# EAGLE design interface-2-cart (EAGLE 9.4.2)
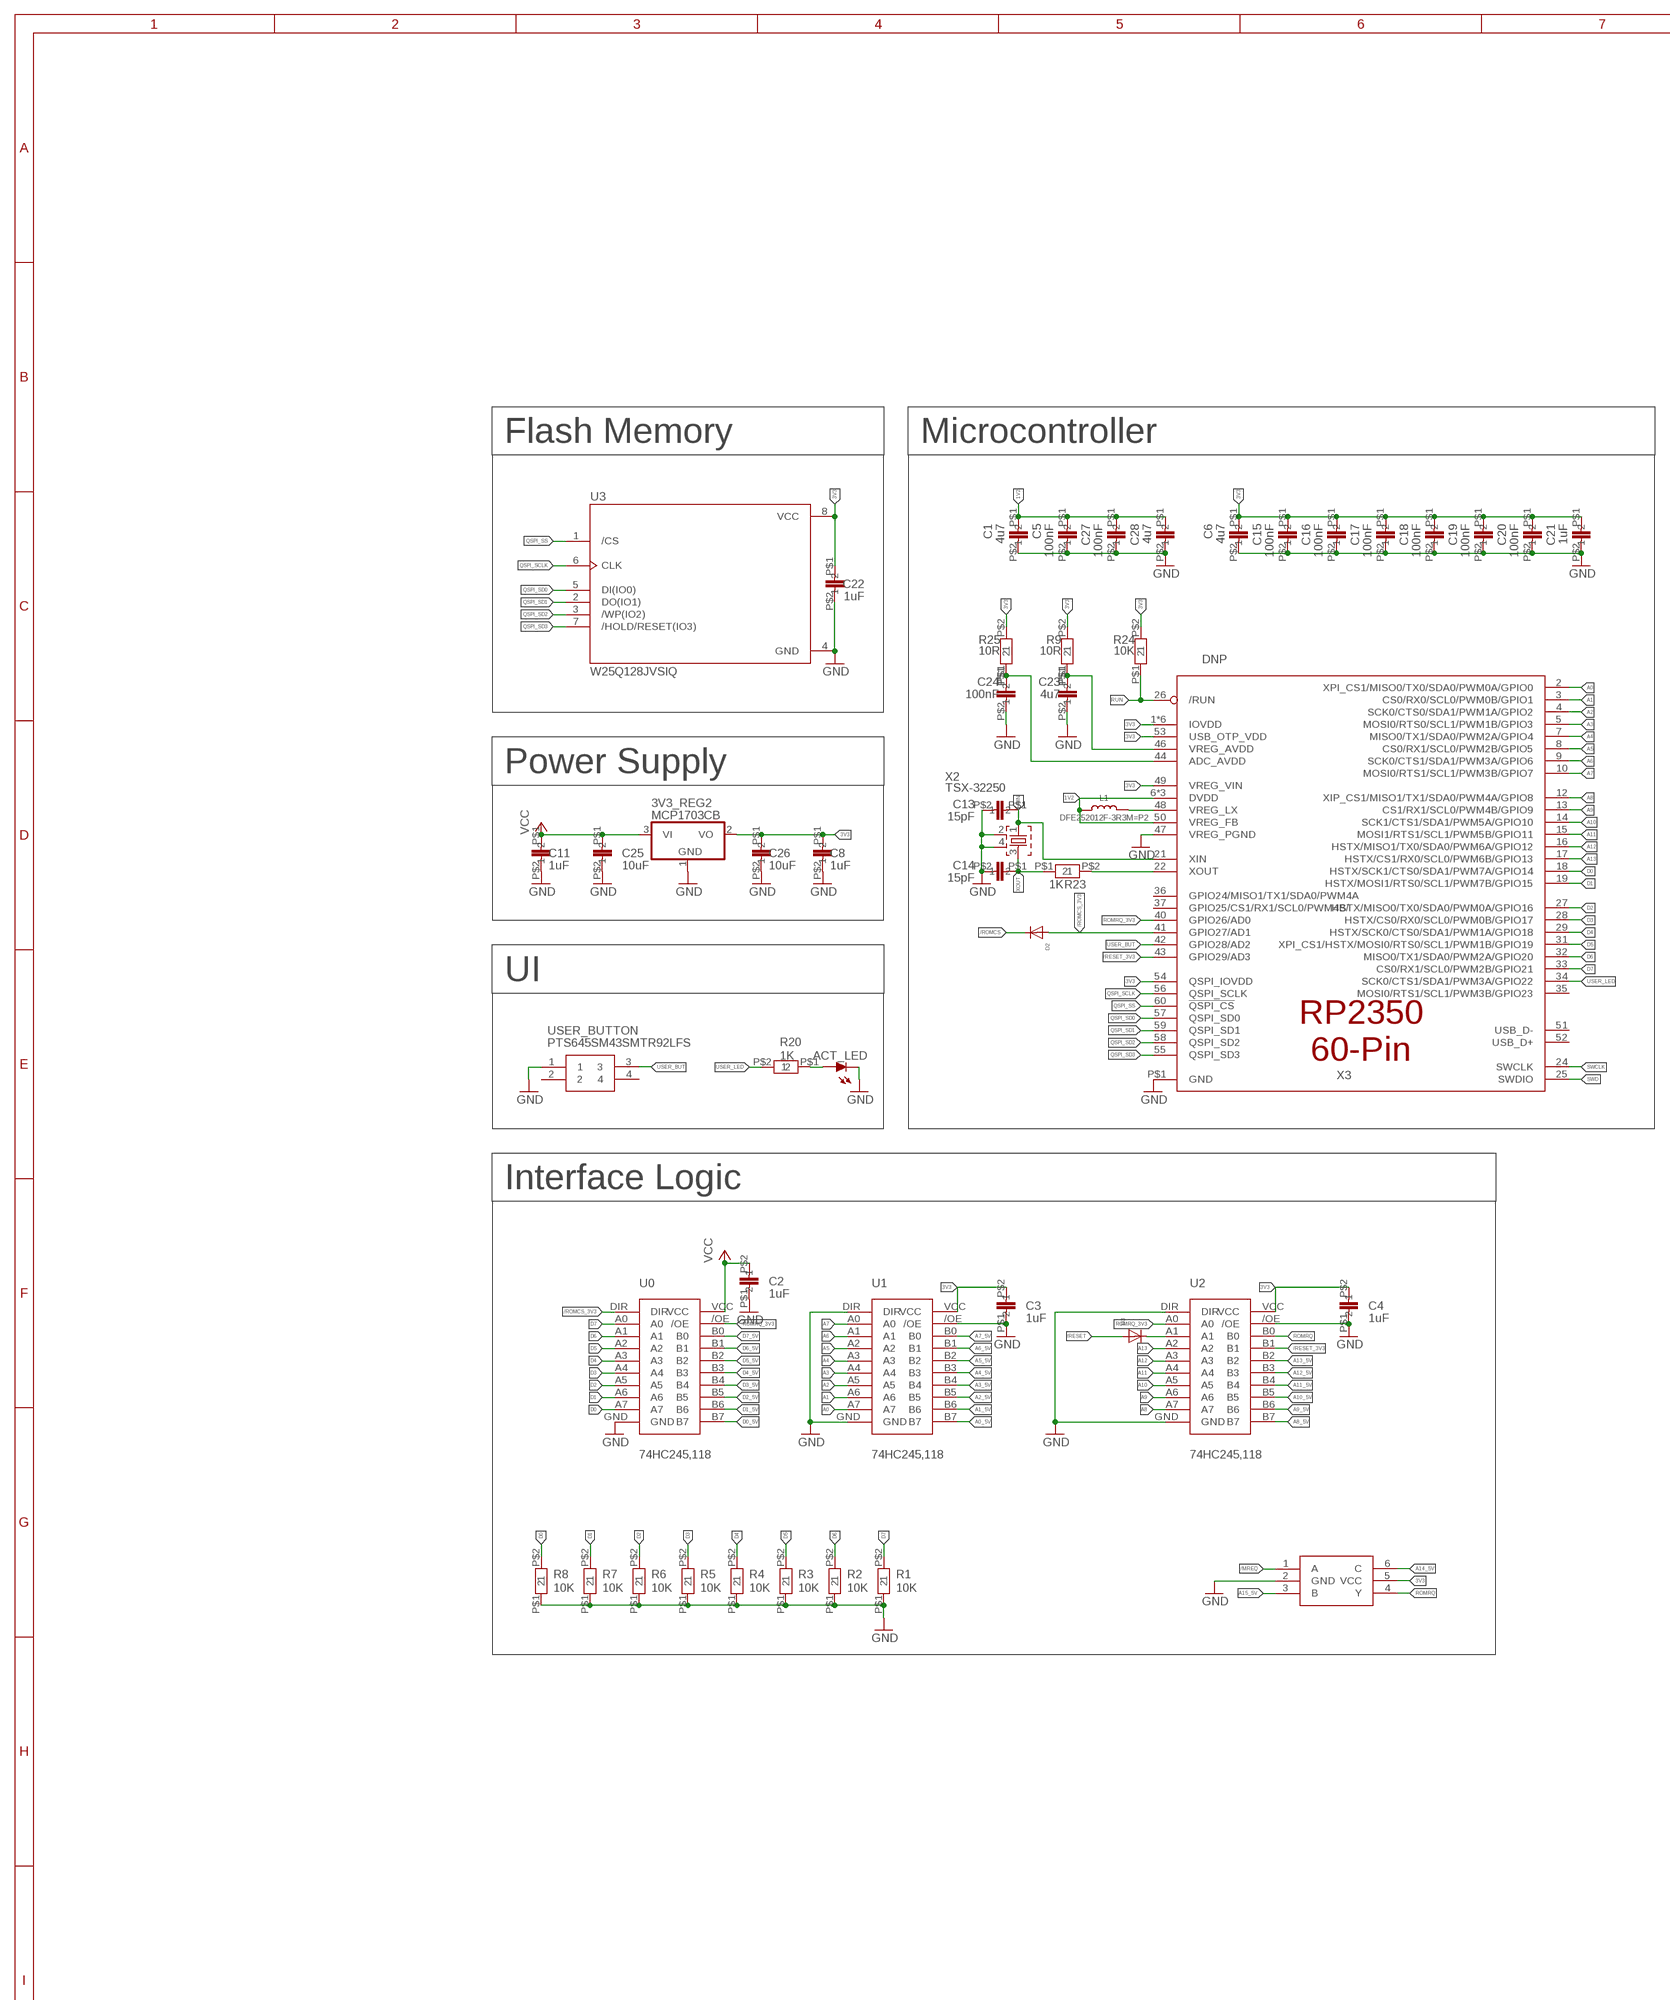
[diagram p0: schematic, sheet 1, part 1 of 2]
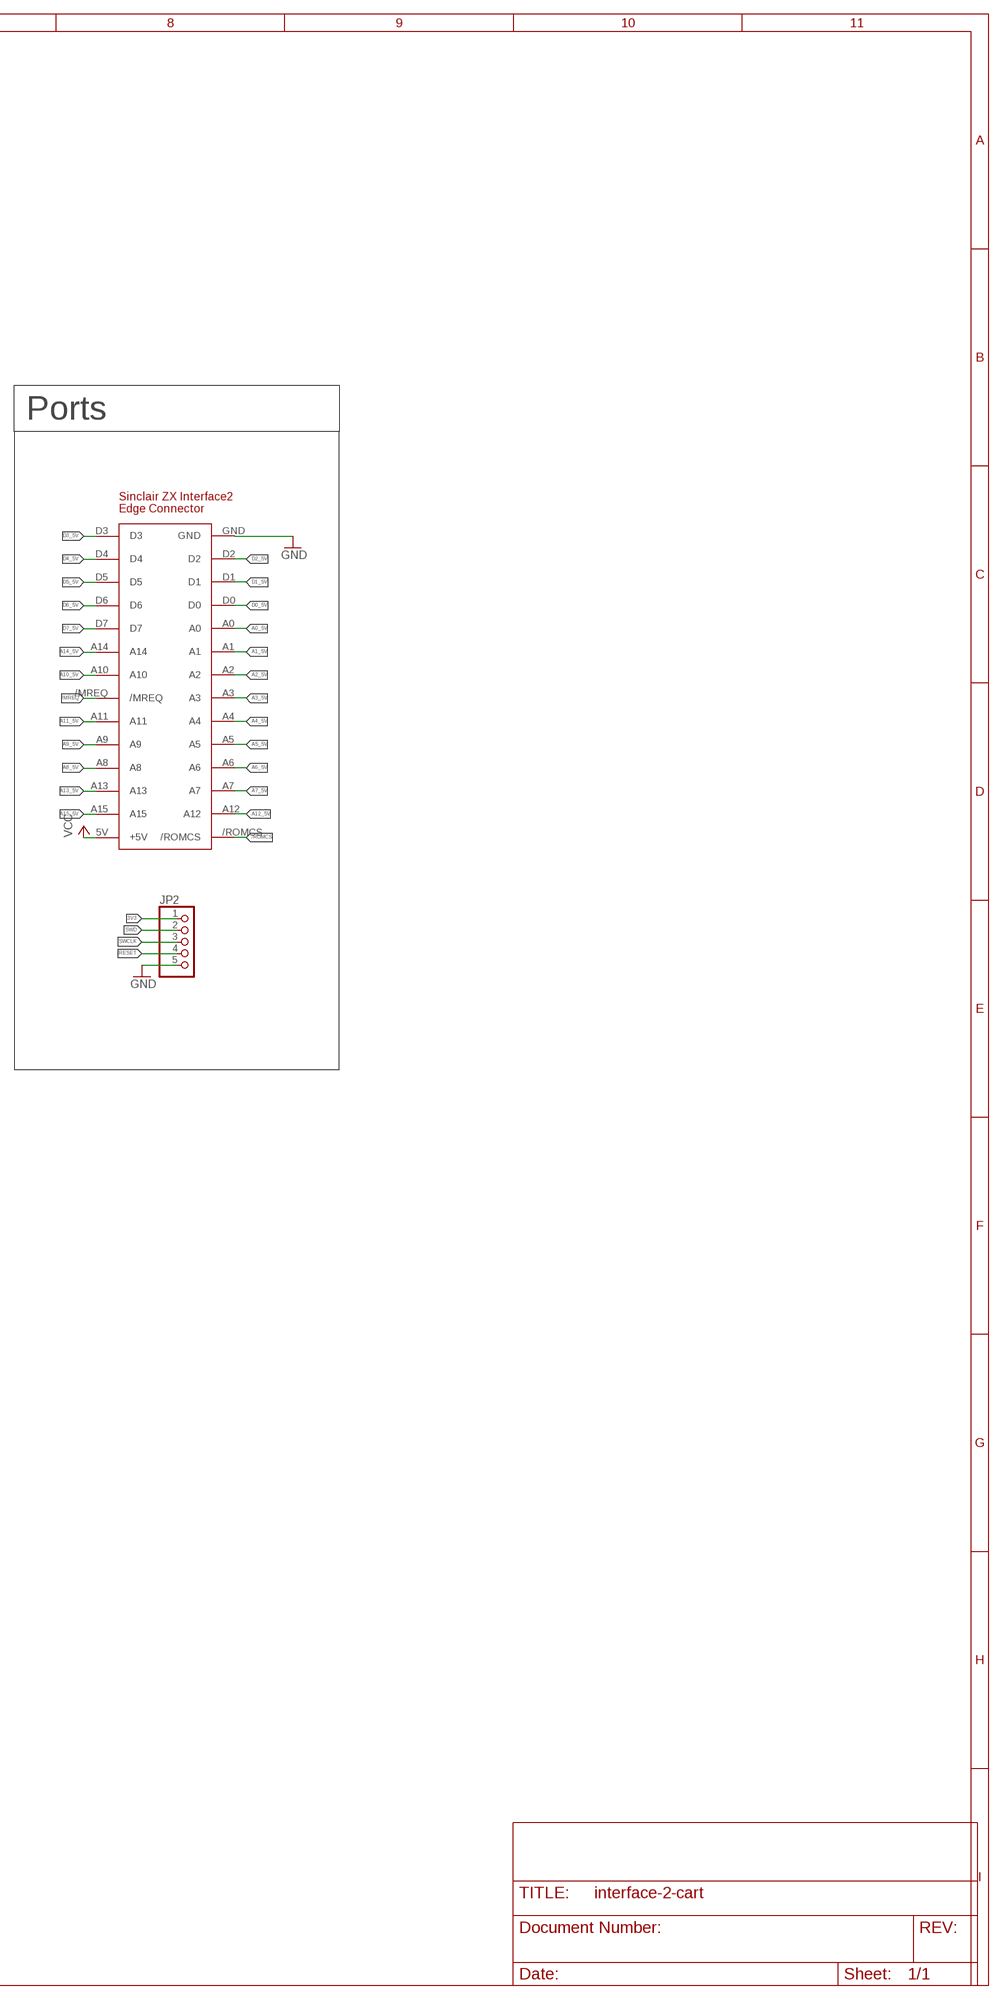
[diagram p1: schematic, sheet 1, part 2 of 2]

## Parts
3V3_REG2  MCP1703CB  [SOT23]
ACT_LED  20mA  LED_LEDCHIP-LED0603MP  [LED_CHIP-LED0603MP]
C1  4u7  CAP-0402  [C0402]
C2  1uF  CAP-0402  [C0402]
C3  1uF  CAP-0402  [C0402]
C4  1uF  CAP-0402  [C0402]
C5  100nF  CAP-0402  [C0402]
C6  4u7  CAP-0402  [C0402]
C8  1uF  CAP-0402  [C0402]
C11  1uF  CAP-0402  [C0402]
C13  15pF  CAP-0402  [C0402]
C14  15pF  CAP-0402  [C0402]
C15  100nF  CAP-0402  [C0402]
C16  100nF  CAP-0402  [C0402]
C17  100nF  CAP-0402  [C0402]
C18  100nF  CAP-0402  [C0402]
C19  100nF  CAP-0402  [C0402]
C20  100nF  CAP-0402  [C0402]
C21  1uF  CAP-0402  [C0402]
C22  1uF  CAP-0402  [C0402]
C23  4u7  CAP-0402  [C0402]
C24  100nF  CAP-0402  [C0402]
C25  10uF  CAP-0402  [C0402]
C26  10uF  CAP-0402  [C0402]
C27  100nF  CAP-0402  [C0402]
C28  4u7  CAP-0402  [C0402]
D2  DIODESOD-323F  [SOD-323F]
D3  DIODESOD-323F  [SOD-323F]
JP2  PINHD-1X5  [1X05]
L1  DFE252012F-3R3M=P2  INDUCTOR  [INDUCTOR_1007]
R1  10K  RES-0402  [0402]
R2  10K  RES-0402  [0402]
R3  10K  RES-0402  [0402]
R4  10K  RES-0402  [0402]
R5  10K  RES-0402  [0402]
R6  10K  RES-0402  [0402]
R7  10K  RES-0402  [0402]
R8  10K  RES-0402  [0402]
R9  10R  RES-0402  [0402]
R20  1K  RES-0402  [0402]
R23  1K  RES-0402  [0402]
R24  10K  RES-0402  [0402]
R25  10R  RES-0402  [0402]
U0  SOP65P640X110-20N  [SOP65P640X110-20N]
U1  SOP65P640X110-20N  [SOP65P640X110-20N]
U2  SOP65P640X110-20N  [SOP65P640X110-20N]
U3  W25Q128JVSIQ  [SOIC127P790X216-8N]
U$1  ZX_I2_ROM_EDGE_CONNECTOR  [ZX_I2_ROM_EDGE_CONNECTOR_V2]
U$2  74LVC1G332GW,125  [SOP65P210X110-6N]
USER_BUTTON  PTS645SM43SMTR92LFS  [PTS645(SMT)]
X2  TSX-32250  [TSX-3225]
X3  DNP  RP2350_QFN60  [QFN60_7MM_REDUCEDEPAD]

## Nets
1V2: C1.P$1 C5.P$1 C27.P$1 C28.P$1 L1.P$1 X3.6(DVDD) X3.23(DVDD) X3.39(DVDD) X3.50(VREG_FB)
3V3: 3V3_REG2.2(VO) C3.P$2 C4.P$2 C6.P$1 C8.P$1 C15.P$1 C16.P$1 C17.P$1 C18.P$1 C19.P$1 C20.P$1 C21.P$1 C22.P$1 C26.P$1 JP2.1 R9.P$2 R24.P$2 R25.P$2 U1.VCC U2.VCC U3.8(VCC) U$2.5(VCC) X3.1(IOVDD) X3.11(IOVDD) X3.20(IOVDD) X3.30(IOVDD) X3.38(IOVDD) X3.45(IOVDD) X3.49(VREG_VIN) X3.53(USB_OTP_VDD) X3.54(QSPI_IOVDD)
/MREQ: U$1./MREQ U$2.1(A)
/RESET: D3.A JP2.4
/RESET_3V3: U2.B1 X3.43(GPIO29/AD3)
/ROMCS: D2.C U$1./ROMCS
/ROMCS_3V3: D2.A U0.DIR X3.41(GPIO27/AD1)
A0: U1.A7 X3.2(XPI_CS1/MISO0/TX0/SDA0/PWM0A/GPIO0)
A0_5V: U1.B7 U$1.A0
A1: U1.A6 X3.3(CS0/RX0/SCL0/PWM0B/GPIO1)
A1_5V: U1.B6 U$1.A1
A2: U1.A5 X3.4(SCK0/CTS0/SDA1/PWM1A/GPIO2)
A2_5V: U1.B5 U$1.A2
A3: U1.A4 X3.5(MOSI0/RTS0/SCL1/PWM1B/GPIO3)
A3_5V: U1.B4 U$1.A3
A4: U1.A3 X3.7(MISO0/TX1/SDA0/PWM2A/GPIO4)
A4_5V: U1.B3 U$1.A4
A5: U1.A2 X3.8(CS0/RX1/SCL0/PWM2B/GPIO5)
A5_5V: U1.B2 U$1.A5
A6: U1.A1 X3.9(SCK0/CTS1/SDA1/PWM3A/GPIO6)
A6_5V: U1.B1 U$1.A6
A7: U1.A0 X3.10(MOSI0/RTS1/SCL1/PWM3B/GPIO7)
A7_5V: U1.B0 U$1.A7
A8: U2.A7 X3.12(XIP_CS1/MISO1/TX1/SDA0/PWM4A/GPIO8)
A8_5V: U2.B7 U$1.A8
A9: U2.A6 X3.13(CS1/RX1/SCL0/PWM4B/GPIO9)
A9_5V: U2.B6 U$1.A9
A10: U2.A5 X3.14(SCK1/CTS1/SDA1/PWM5A/GPIO10)
A10_5V: U2.B5 U$1.A10
A11: U2.A4 X3.15(MOSI1/RTS1/SCL1/PWM5B/GPIO11)
A11_5V: U2.B4 U$1.A11
A12: U2.A3 X3.16(HSTX/MISO1/TX0/SDA0/PWM6A/GPIO12)
A12_5V: U2.B3 U$1.A12
A13: U2.A2 X3.17(HSTX/CS1/RX0/SCL0/PWM6B/GPIO13)
A13_5V: U2.B2 U$1.A13
A14_5V: U$1.A14 U$2.6(C)
A15_5V: U$1.A15 U$2.3(B)
D0: R8.P$2 U0.A7 X3.18(HSTX/SCK1/CTS0/SDA1/PWM7A/GPIO14)
D0_5V: U0.B7 U$1.D0
D1: R7.P$2 U0.A6 X3.19(HSTX/MOSI1/RTS0/SCL1/PWM7B/GPIO15)
D1_5V: U0.B6 U$1.D1
D2: R6.P$2 U0.A5 X3.27(HSTX/MISO0/TX0/SDA0/PWM0A/GPIO16)
D2_5V: U0.B5 U$1.D2
D3: R5.P$2 U0.A4 X3.28(HSTX/CS0/RX0/SCL0/PWM0B/GPIO17)
D3_5V: U0.B4 U$1.D3
D4: R4.P$2 U0.A3 X3.29(HSTX/SCK0/CTS0/SDA1/PWM1A/GPIO18)
D4_5V: U0.B3 U$1.D4
D5: R3.P$2 U0.A2 X3.31(XPI_CS1/HSTX/MOSI0/RTS0/SCL1/PWM1B/GPIO19)
D5_5V: U0.B2 U$1.D5
D6: R2.P$2 U0.A1 X3.32(MISO0/TX1/SDA0/PWM2A/GPIO20)
D6_5V: U0.B1 U$1.D6
D7: R1.P$2 U0.A0 X3.33(CS0/RX1/SCL0/PWM2B/GPIO21)
D7_5V: U0.B0 U$1.D7
GND: 3V3_REG2.1(GND) ACT_LED.C C1.P$2 C2.P$1 C3.P$1 C4.P$1 C5.P$2 C6.P$2 C8.P$2 C11.P$2 C13.P$2 C14.P$2 C15.P$2 C16.P$2 C17.P$2 C18.P$2 C19.P$2 C20.P$2 C21.P$2 C22.P$2 C23.P$2 C24.P$2 C25.P$2 C26.P$2 C27.P$2 C28.P$2 JP2.5 R1.P$1 R2.P$1 R3.P$1 R4.P$1 R5.P$1 R6.P$1 R7.P$1 R8.P$1 U0.GND U1./OE U1.DIR U1.GND U2./OE U2.DIR U2.GND U3.4(GND) U$1.GND U$2.2(GND) USER_BUTTON.1 X2.2 X2.4 X3.47(VREG_PGND) X3.P$1(GND)
N$6: ACT_LED.A R20.P$1
N$9: D3.C U2.A1
N$10: R23.P$2 X3.22(XOUT)
N$11: L1.P$2 X3.48(VREG_LX)
N$12: C23.P$1 R9.P$1 X3.46(VREG_AVDD)
N$13: C24.P$1 R25.P$1 X3.44(ADC_AVDD)
QSPI_SCLK: U3.6(CLK) X3.56(QSPI_SCLK)
QSPI_SD0: U3.5(DI(IO0)) X3.57(QSPI_SD0)
QSPI_SD1: U3.2(DO(IO1)) X3.59(QSPI_SD1)
QSPI_SD2: U3.3(/WP(IO2)) X3.58(QSPI_SD2)
QSPI_SD3: U3.7(/HOLD/RESET(IO3)) X3.55(QSPI_SD3)
QSPI_SS: U3.1(/CS) X3.60(!QSPI_CS)
ROMRQ: U2.B0 U$2.4(Y)
ROMRQ_3V3: U0./OE U2.A0 X3.40(GPIO26/AD0)
RUN: R24.P$1 X3.26(/RUN)
SWCLK: JP2.3 X3.24(SWCLK)
SWD: JP2.2 X3.25(SWDIO)
USER_BUT: USER_BUTTON.3 X3.42(GPIO28/AD2)
USER_LED: R20.P$2 X3.34(SCK0/CTS1/SDA1/PWM3A/GPIO22)
VCC: 3V3_REG2.3(VI) C2.P$2 C11.P$1 C25.P$1 U0.VCC U$1.5V(+5V)
XIN: C13.P$1 X2.1 X3.21(XIN)
XOUT: C14.P$1 R23.P$1 X2.3
Unconnected: USER_BUTTON.2 USER_BUTTON.4 X3.35(MOSI0/RTS1/SCL1/PWM3B/GPIO23) X3.36(GPIO24/MISO1/TX1/SDA0/PWM4A) X3.37(GPIO25/CS1/RX1/SCL0/PWM4B/) X3.51(USB_D-) X3.52(USB_D+)

## Notes on the sheet
- Flash Memory | Microcontroller | Ports
- Power Supply
- UI
- Interface Logic

## Library data of the parts
3V3_REG2 = linear:MCP1703: 250 mA, 16V, Low Quiescent Current LDO Regulator Source: http://ww1.microchip.com/downloads/en/DeviceDoc/22049b.pdf
ACT_LED = 52101-101-REV-A_v16:LED_LED: LED Various Types
C1-C6 C8 C11 C13-C28 = res-small-footprint:CAP-0402
D2 D3 = adafruit:DIODE: Diode SMADIODE - SMA Surface Mount Package 20V 1A Schottky Diode Digikey: 641-1014-6-ND DO-1N4148 - Through Hole Small Current Diode SOD-123 20V 1 A (.5mV Vf) Schottky Diode - Digikey: MBRX120TPMSCT-ND SOD-323 10V 570mA (.38mV Vf, 3ns) Schottky Diode - Digikey: ZLLS410CT-ND SOD-523 30V 30mA Schottky Diode (RB751S-40TE61) - Digikey: RB751S-40TE61CT-ND SOT23-R/W - SOT23 Package (R = Solder Paste/Reflow Ovens, W = Hand-Soldering) BAT54Film 40V 300mA - Digikey: 497-7162-1-ND
JP2 = pinhead:PINHD-1X5: PIN HEADER
L1 = microbuilder:INDUCTOR: Inductors 0603: 10nH Ceramic Inductor - microwire antenna/RF (Digikey: 712-1434-2-ND) 0805: 560nH Ceramic Inductor - RF (Digikey: 553-1047-1-ND) 270nH Ceramic Inductor - Q = 40@250MHz, +-5%, 1 Ohm DC Resistance (Digikey: 535-10506-2-ND) 1007 (2518 Metric) SMT: 10µH 10% 250mOhm 820mA 1007 Inductor (Digikey: 587-2189-1-ND) 22µH 10% 500mOhm 580mA 1007 Inductor (Digikey: 587-2190-1-ND) 47µH 10% 950mOhm 420mA 1007 Inductor (Digikey: 587-2191-1-ND) 47µH 5% 100mOhm 1A 1008 Inductor (Digikey: 732-1816-1-ND) 5.0x5.0mm (Taiyo Yuden NR5040 Series) 6.8µH 20% 2.3A 64mOhm Inductor (Digikey: 587-2374-2-ND) 5.0x5.0mm (TDK VLC5045 Series) 4.7µH 20% 3.3A 34mOhm Inductor (Digikey: 445-6526-1-ND) 6.8µH 20% 2.7A 46mOhm Inductor (Digikey: 445-6527-1-ND) 6.0x6.0mm (TDK VLC6045 Series) 4.7µH 20% 3.8A 27mOhm Inductor (Digikey: 445-6538-2-ND) 6.8µH 20% 3A 41mOhm Inductor (Digikey: 445-6540-1-ND) 6.2µH 30% 2.2A 45mOhm Inductor (Digikey: SRR5028-6R2YCT-ND) - Not TDK VLC6045 but footprint should match 6.0x6.0mm (TDK SLF6045 Series) 6.8uH 30% 2A 33mOhm Inductor (Digikey: 445-4572-1-ND, Mouser: 810-SLF645T6R8N2R0PF) 6.0x6.0mm (Sumida CDRH5D28 Series) 6.2uH 30% 1.8A 45mOhm Inductor (Digikey: 308-1542-1-ND) Taiyo Yuden NR3015T2R2M - 2.2uH 20% 1.5A (Digikey: 587-1648-2-ND, Mouser: 963-NR3015T2R2M) - Used with TI TPS62172 CoilCraft RFID Transponder Coil - MA5532-AE (For use with AS3935 Lightning Sensor) Taiyo Yuden NRH2412T2R2MNGH - 2.2uH 20% 1AA (Digikey: 587-3443-1-ND) - Used with TI LM3671 Vishay IHLP 1.0uH Molded Inductor - 24mOhm DCR, 5A, +/-20%, -55°C-125°C (Digikey: 541-1319-1-ND)
R1-R9 R20 R23-R25 = res-small-footprint:RES-0402
U0 U1 U2 = SOP65P640X110-20N:SOP65P640X110-20N; A1_MIN: 0.05; A_MAX: 1.1; A_MIN: 1.1; A_NOM: 1.1; B_MAX: 0.3; B_MIN: 0.19; B_NOM: 0.245; D2_MAX: 0.0; D_MAX: 6.6; D_MIN: 6.4; D_NOM: 6.5; E1_MAX: 4.5; E1_MIN: 4.3; E1_NOM: 4.4; E2_MAX: 0.0; ENOM: 0.65; E_MAX: 6.6; E_MIN: 6.2; E_NOM: 6.4; L_MAX: 0.75; L_MIN: 0.5; L_NOM: 0.625; MANUFACTURER: Nexperia USA; PIN_COUNT: 20.0; SNAPEDA_PACKAGE_ID: 105184; STANDARD: IPC 7351B
U3 = W25Q128JVSIQ:W25Q128JVSIQ: Check availability <https://pricing.snapeda.com/parts/W25Q128JVSIQ/Winbond%20Electronics/view-part?ref=eda>; AVAILABILITY: In Stock; CHECK_PRICES: https://www.snapeda.com/parts/W25Q128JVSIQ/Winbond+Electronics/view-part/?ref=eda; DESCRIPTION: FLASH - NOR Memory IC 128Mb (16M x 8) SPI - Quad I/O, QPI, DTR 133 MHz 8-SOIC; MF: Winbond Electronics; MP: W25Q128JVSIQ; PACKAGE: SOIC-8 Winbond Electronics; PRICE: None; PURCHASE-URL: https://www.snapeda.com/api/url_track_click_mouser/?unipart_id=1054022&manufacturer=Winbond Electronics&part_name=W25Q128JVSIQ&search_term=None; SNAPEDA_LINK: https://www.snapeda.com/parts/W25Q128JVSIQ/Winbond+Electronics/view-part/?ref=snap
U$1 = zxs_i2_rom_edge_connector:ZX_I2_ROM_EDGE_CONNECTOR: Edge connector pro ROM modul pro Interface 2 počítače ZX Spectrum
U$2 = 74LVC1G332GW_125:74LVC1G332GW,125
USER_BUTTON = PTS645SM43SMTR92LFS:PTS645SM43SMTR92LFS: C & K COMPONENTS - PTS645SM43SMTR92LFS - SWITCH, SPST, 0.05A, 12VDC, SMD, 4.3MM Source: Datasheet <http://www.farnell.com/datasheets/1914518.pdf>; DESCRIPTION: C & K COMPONENTS - PTS645SM43SMTR92LFS - SWITCH, SPST, 0.05A, 12VDC, SMD, 4.3MM; HEIGHT: mm; MANUFACTURER_NAME: C & K COMPONENTS; MANUFACTURER_PART_NUMBER: PTS645SM43SMTR92LFS; MOUSER_PART_NUMBER: 611-PTS645SM43SMTR92; MOUSER_PRICE-STOCK: https://www.mouser.com/Search/Refine.aspx?Keyword=611-PTS645SM43SMTR92
X2 = TSX-3225:TSX-3225: MHz RANGE CRYSTAL UNIT Source: Epson Toyocom Check availability <https://pricing.snapeda.com/parts/TSX-3225/EPSON/view-part?ref=eda>; AVAILABILITY: Not in stock; DESCRIPTION: 38.4MHz ±10ppm Crystal 8.5pF 40 Ohms 4-SMD, No Lead; MF: EPSON; MP: TSX-3225; PACKAGE: SMD-4 EPSON; PRICE: None
X3 = adafruit_micro:RP2350

## Board
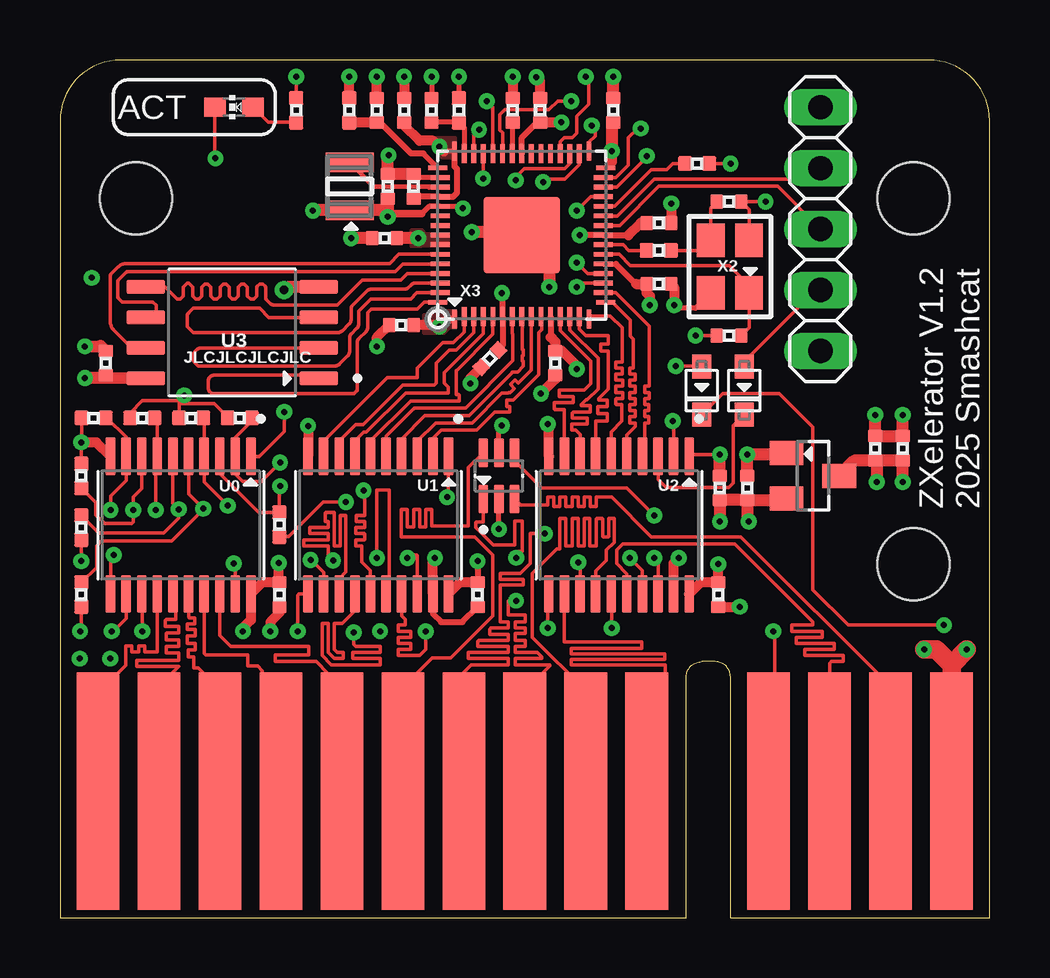
[diagram p2: board, top side]
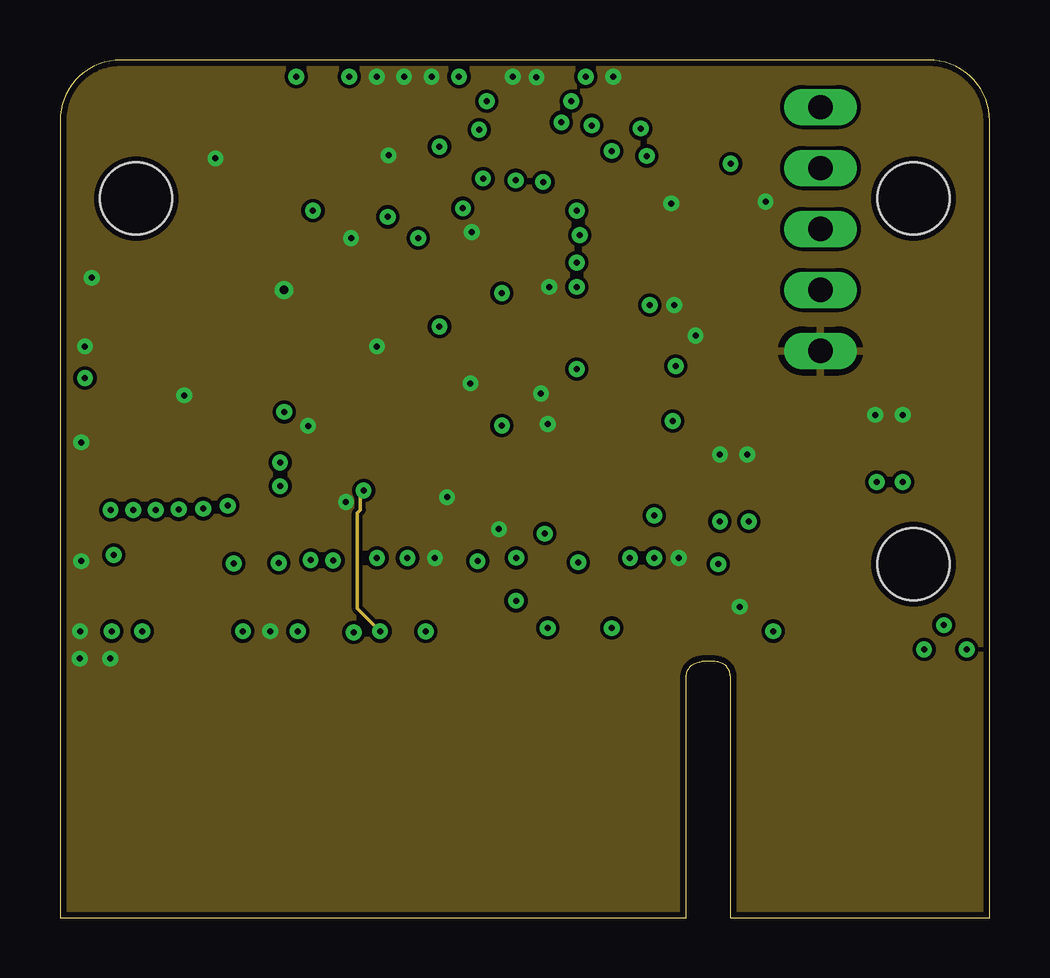
[diagram p3: board, inner layer Route2]
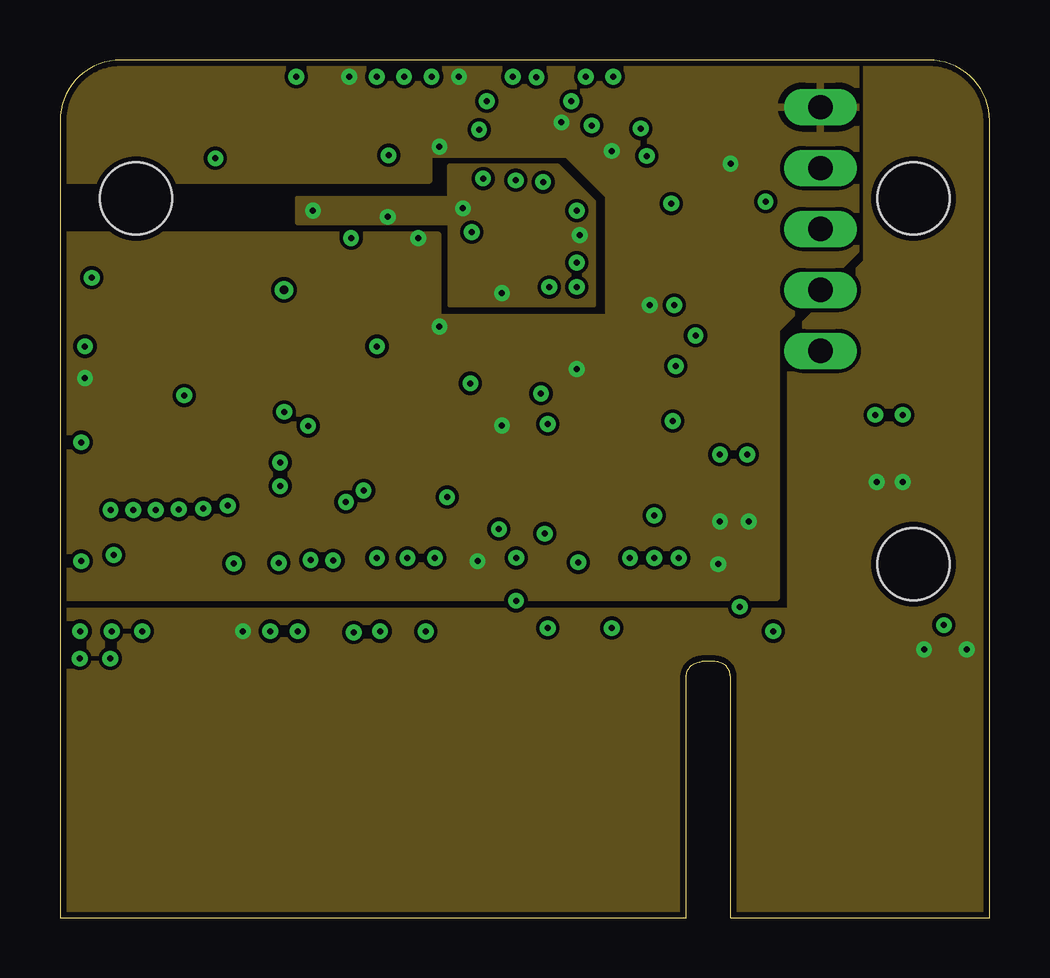
[diagram p4: board, inner layer Route15]
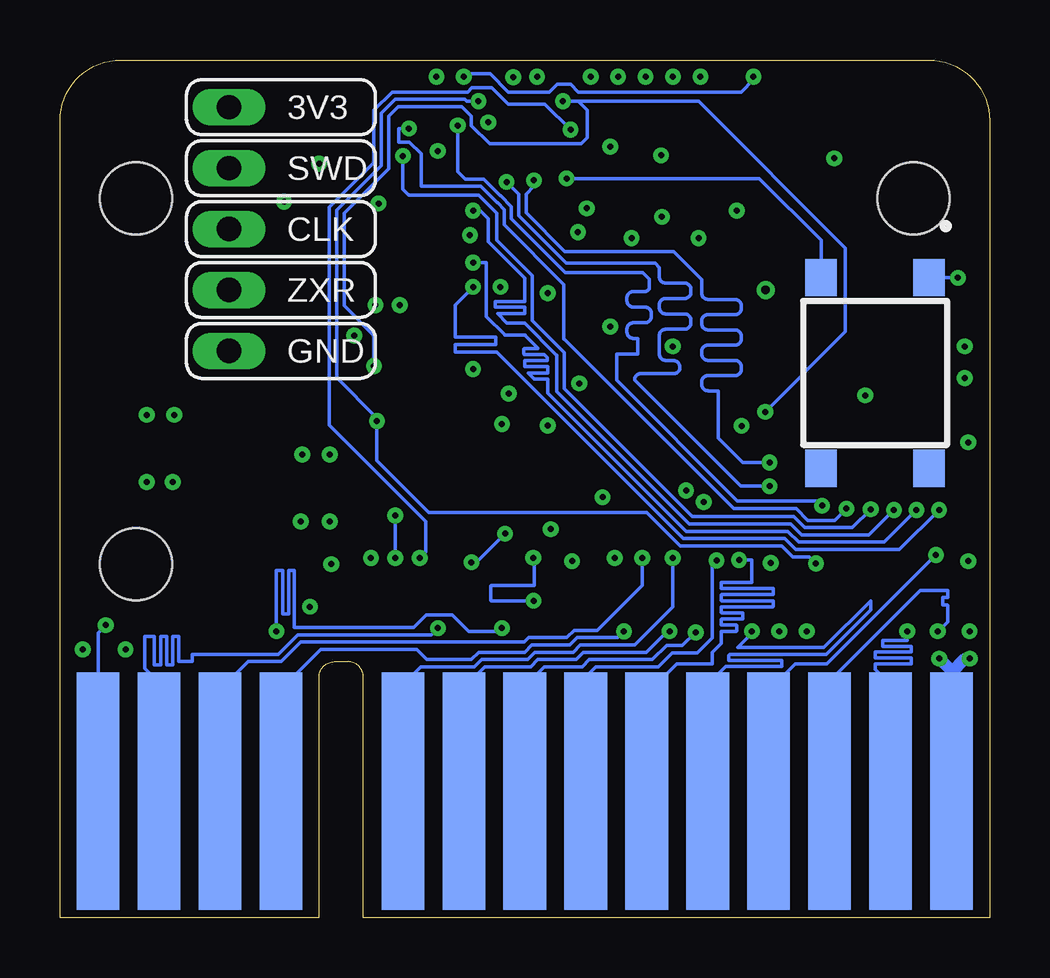
[diagram p5: board, bottom side, seen from below]

Size 38.73 x 35.75 mm. Coordinates in mm from the lower left corner, seen from the top.
Outline: 0,0 26.1,0 26.1,10.03 arc-90 26.73,10.67 27.3,10.67 arc-90 27.94,10.03 27.94,0 38.73,0 38.73,33.21 arc90 36.2,35.75 2.54,35.75 arc90 0,33.21 0,0
Copper layers (1+2*15+16): Top 0.035mm / dielectric 0.1mm / Route2 0.0175mm / dielectric 1.265mm / Route15 0.0175mm / dielectric 0.1mm / Bottom 0.035mm
Design rules "moje_1 *": minimum track width 6mil, minimum drill 0.2mm, track to track 6mil, track to pad 6mil, pad to pad 6mil, via to via 6mil, smd to smd 6mil, copper to edge 10mil, drill to drill 6mil, minimum pad ring 10mil, minimum via ring 8mil, stop-mask expansion 4mil, vias tented up to drill 0mil, thermal gap 10mil
Holes 3 mm at 3.17,29.97 35.56,29.97 35.56,14.73

### Footprints (pad centres in the part's own frame; a part is rotated, then mirrored left to right if it is on the bottom)
SOT23 = smd 1 x 1.4: 1 -0.95,-1.1; 2 0.95,-1.1; 3 0,1.1
LED_CHIP-LED0603MP = smd 0.8 x 0.9: A 0,-0.794; C 0,0.794
C0402 = smd 0.524 x 0.6: P$1 -0.508,0; P$2 0.508,0
SOD-323F = smd 1 x 0.8: A -1,0; C 1,0
1X05 = drill 1.016 long: 1 -5.08,0; 2 -2.54,0; 3 0,0; 4 2.54,0; 5 5.08,0
INDUCTOR_1007 = smd 0.8 x 2: P$1 -1,0; P$2 1,0
0402 = smd 0.6 x 0.6: P$1 -0.5,0; P$2 0.5,0
SOP65P640X110-20N = smd 1.57 x 0.41: /OE 2.87,2.275; A0 -2.87,2.275; A1 -2.87,1.625; A2 -2.87,0.975; A3 -2.87,0.325; A4 -2.87,-0.325; A5 -2.87,-0.975; A6 -2.87,-1.625; A7 -2.87,-2.275; B0 2.87,1.625; B1 2.87,0.975; B2 2.87,0.325; B3 2.87,-0.325; B4 2.87,-0.975; B5 2.87,-1.625; B6 2.87,-2.275; B7 2.87,-2.925; DIR -2.87,2.925; GND -2.87,-2.925; VCC 2.87,2.925
SOIC127P790X216-8N = smd 1.61 x 0.58: 1 -3.605,1.905; 2 -3.605,0.635; 3 -3.605,-0.635; 4 -3.605,-1.905; 5 3.605,-1.905; 6 3.605,-0.635; 7 3.605,0.635; 8 3.605,1.905
ZX_I2_ROM_EDGE_CONNECTOR_V2 = smd 1.778 x 9.906: 5V 10.16,5.08; /MREQ -7.62,5.08; A8 2.54,5.08; A9 -2.54,5.08; A10 -10.16,5.08; A11 -5.08,5.08; A13 5.08,5.08; A14 -12.7,5.08; A15 7.62,5.08; D3 -25.4,5.08; D4 -22.86,5.08; D5 -20.32,5.08; D6 -17.78,5.08; D7 -15.24,5.08 | smd 1.778 x 9.906 bottom: /ROMCS 10.16,5.08; A0 -15.24,5.08; A1 -12.7,5.08; A2 -10.16,5.08; A3 -7.62,5.08; A4 -5.08,5.08; A5 -2.54,5.08; A6 2.54,5.08; A7 5.08,5.08; A12 7.62,5.08; D0 -17.78,5.08; D1 -20.32,5.08; D2 -22.86,5.08; GND -25.4,5.08
SOP65P210X110-6N = smd 1.19 x 0.4: 1 -0.96,0.65; 2 -0.96,0; 3 -0.96,-0.65; 4 0.96,-0.65; 5 0.96,0; 6 0.96,0.65
PTS645(SMT) = smd 1.55 x 1.3: 1 -3.975,2.25; 2 3.975,2.25; 3 -3.975,-2.25; 4 3.975,-2.25
TSX-3225 = smd 1.4 x 1.15: 1 0,-1.6; 2 2.2,-1.6; 3 2.2,0; 4 0,0
QFN60_7MM_REDUCEDEPAD = smd 0.8 x 0.2: 1 -3.5,2.8; 2 -3.4,2.4; 3 -3.4,2; 4 -3.4,1.6; 5 -3.4,1.2; 6 -3.4,0.8; 7 -3.4,0.4; 8 -3.4,0; 9 -3.4,-0.4; 10 -3.4,-0.8; 11 -3.4,-1.2; 12 -3.4,-1.6; 13 -3.4,-2; 14 -3.4,-2.4; 15 -3.5,-2.8; 31 3.5,-2.8; 32 3.4,-2.4; 33 3.4,-2; 34 3.4,-1.6; 35 3.4,-1.2; 36 3.4,-0.8; 37 3.4,-0.4; 38 3.4,0; 39 3.4,0.4; 40 3.4,0.8; 41 3.4,1.2; 42 3.4,1.6; 43 3.4,2; 44 3.4,2.4; 45 3.5,2.8 | smd 0.2 x 0.8: 16 -2.8,-3.5; 17 -2.4,-3.4; 18 -2,-3.4; 19 -1.6,-3.4; 20 -1.2,-3.4; 21 -0.8,-3.4; 22 -0.4,-3.4; 23 0,-3.4; 24 0.4,-3.4; 25 0.8,-3.4; 26 1.2,-3.4; 27 1.6,-3.4; 28 2,-3.4; 29 2.4,-3.4; 30 2.8,-3.5; 46 2.8,3.5; 47 2.4,3.4; 48 2,3.4; 49 1.6,3.4; 50 1.2,3.4; 51 0.8,3.4; 52 0.4,3.4; 53 0,3.4; 54 -0.4,3.4; 55 -0.8,3.4; 56 -1.2,3.4; 57 -1.6,3.4; 58 -2,3.4; 59 -2.4,3.4; 60 -2.8,3.5 | smd 3.2 x 3.2: P$1 0,0

### Placement (x,y rotation side)
3V3_REG2  31.37,18.41 270 top
ACT_LED  7.25,33.78 90 top
C1  24.96,28.96 0 top
C2  9.14,13.46 90 top
C3  20,33.66 270 top
C4  17.4,13.46 90 top
C5  18.86,33.66 90 top
C6  14.73,30.48 90 top
C8  28.64,17.91 90 top
C11  33.97,19.56 90 top
C13  27.88,24.26 180 top
C14  27.88,29.84 0 top
C15  24.96,26.42 0 top
C16  20.64,23.11 270 top
C17  27.43,13.46 270 top
C18  1.91,23.11 90 top
C19  14.22,24.7 180 top
C20  14.34,33.66 90 top
C21  13.53,28.32 180 top
C22  23.05,33.66 90 top
C23  13.2,33.66 90 top
C24  15.48,33.66 90 top
C25  35.12,19.56 90 top
C26  27.5,17.91 90 top
C27  17.91,23.3 225 top
C28  13.65,30.48 90 top
D2  26.73,21.97 270 top
D3  28.51,21.97 270 top
JP2  31.69,28.7 270 top
L1  12.06,30.48 90 top
R1  7.49,20.83 0 top
R2  9.14,16.38 90 top
R3  5.46,20.83 0 top
R4  0.89,13.46 90 top
R5  0.89,16.26 90 top
R6  3.43,20.83 0 top
R7  0.89,18.41 270 top
R8  1.4,20.83 0 top
R9  12.05,33.66 90 top
R20  9.84,33.66 90 top
R23  24.96,27.81 180 top
R24  26.54,31.43 0 top
R25  16.62,33.66 90 top
U0  5.03,16.36 270 top
U1  13.26,16.36 270 top
U2  23.29,16.36 270 top
U3  7.18,24.38 180 top
U$1  26.99,0.19 0 top
U$2  18.29,18.41 90 top
USER_BUTTON  4.78,22.71 270 bottom
X2  27.11,26.04 90 top
X3  19.24,28.45 90 top

### Tracks (layer width: path | path; a pad name or v marks a point on that pad's centre or on a via)
1V2  (via drill 0.25)
  Top 0.203: C5.P$1 18.84,33.13 X3.39 | 15.07,29.34 15.38,29.65 X3.50 16.71,29.65 v16.79,29.57
  Top 0.254: 23.69,28.45 X3.23 v21.65,28.45 | v18.41,26.04 18.44,26.01 X3.6 18.44,23.84 C27.P$1
  Top 0.305: v13.65,29.21 13.78,29.34 15.07,29.34
  Top 0.406: C1.P$1 24.19,28.96 23.69,28.45
  Top 0.508: C28.P$1 v13.65,29.21 13.38,29.48 L1.P$1 10.56,29.48 v10.54,29.46
  pour Route15: 9.91,30 16.23,30 16.23,31.34 20.73,31.34 22.23,29.84 22.23,25.53 16.26,25.53 16.26,28.96 9.91,28.96
3V3  (via drill 0.25)
  Top 0.152: R24.P$2 v27.94,31.43
  Top 0.203: U$2.5 18.29,20.26 18.41,20.39 v18.41,20.51 | C3.P$2 19.88,33.15 | X3.45 15.99,31.95 | v16.62,35.05 R25.P$2 | X3.1 16.19,24.95 | X3.20 23.16,27.25 | X3.30 22.99,31.5 | 14.8,30.05 C6.P$1
  Top 0.254: X3.38 19.24,32.51 19.88,33.15 | X3.11 20.44,24.19 | 23.16,27.25 23.99,26.42 | 14.8,30.05 X3.49 16.38,30.05 16.55,30.21 16.55,31.21 16.44,31.31 X3.45 | v17.4,14.86 C4.P$2
  Top 0.356: C18.P$1 1.79,22.49
  Top 0.406: R9.P$2 v12.05,35.05 | C20.P$1 14.34,33.02 14.98,32.38 15.56,32.38 v15.81,32.13 15.99,31.95 | 20.44,24.19 20.64,24 C16.P$1 20.92,23.62 21.53,23.01 v21.53,22.86 | 16.19,24.95 15.88,24.64 v15.81,24.64 15.75,24.7 C19.P$1 | 23.99,26.42 C15.P$1 24.45,26.04 24.57,25.91 v24.57,25.53 | C3.P$2 v20.88,33.16 v20.89,33.15 | v22.99,31.95 22.99,31.5 | C4.P$2 16.67,13.97 U1.VCC | U2.VCC 26.7,13.97 C17.P$1 v27.43,14.73
  Top 0.508: 1.79,22.49 v1.04,22.49 | v14.92,28.32 C21.P$1 | C8.P$1 C26.P$1 v27.5,16.51 | U3.8 1.78,22.49 C18.P$1 | C22.P$1 22.99,33.09 v22.99,31.95 | C8.P$1 30.15,17.4 3V3_REG2.2 | C8.P$1 28.64,16.57 v28.7,16.51
  pour Route15 (rank 2): -2.29,39.37 33.15,39.37 33.15,27.81 29.84,24.51 29.84,13.34 -2.29,13.34 -2.29,28.45 15.75,28.45 15.75,25.02 22.86,25.02 22.86,30.1 21.13,31.83 15.37,31.83 15.37,30.73 -2.29,30.73
  pour Top (no thermals): 15.6,32.51 16.46,32.51 16.46,31.67 15.93,31.67 15.6,32
  pour Top (no thermals): 16.48,24.59 16.23,24.59 16,24.36 15.16,24.36 15.16,25.12 15.72,25.12 15.88,25.27 16.48,25.27
  pour Top (no thermals): 16.18,28.5 15.24,28.5 15.09,28.65 14.63,28.65 14.63,27.99 15.06,27.99 15.09,28.02 16.18,28.02
/MREQ  (via drill 0.25)
  Top 0.152: U$1./MREQ 19.37,9.46 20.4,10.49 20.4,10.54 18.97,10.54 18.97,10.79 20.07,10.79 20.07,10.87 19.89,11.05 18.97,11.05 18.97,11.3 19.38,11.3 19.38,11.56 18.97,11.56 18.97,11.84 19.38,11.84 19.38,12.06 18.97,12.06 18.97,12.32 19.38,12.32 19.38,12.62 18.67,12.62 18.67,13.21 v19,13.21 | v19.01,15 19.01,15.27 19.25,15.27 19.25,16.54 18.95,16.54 18.95,15.53 18.04,15.53 17.32,16.25 17.32,16.46 17.35,16.48 17.63,16.48 17.64,16.5 U$2.1
  Bottom 0.152: v19,13.21 20.75,13.21 arc90 20.78,13.23 20.78,13.82 arc90 20.75,13.84 18.97,13.84 18.97,14.96 v19.01,15
/RESET
  Top 0.152: JP2.4 31.5,26.16 28.51,23.18 D3.A
/RESET_3V3  (via drill 0.25)
  Top 0.152: X3.43 17.24,32.62 v17.46,32.84 | v23.75,14.99 24.27,14.47 U2.B1
  Bottom 0.152: v17.46,32.84 18.53,33.91 20.07,33.91 20.75,34.59 21.58,34.59 21.75,34.42 24.89,34.42 25.65,33.66 25.65,31.47 27.51,29.62 27.51,20.52 23.5,16.51 23.5,15.24 v23.75,14.99
/ROMCS  (via drill 0.25)
  Top 0.152: D2.C 27.61,21.84 29.97,21.84 31.37,20.45 31.37,13.66 32.84,12.19 v36.83,12.19
  Bottom 0.152: U$1./ROMCS 37.15,11.87 v36.83,12.19
/ROMCS_3V3  (via drill 0.25)
  Top 0.152: v17.78,34.04 18.03,33.79 18.03,31.86 X3.41 | v25.65,22.99 26.72,22.99 D2.A | v9.35,21.08 9.35,20.27 8.31,19.23 U0.DIR
  Bottom 0.152: v9.35,21.08 6.01,24.42 6.01,27.91 12.13,34.04 17.14,34.04 | v17.78,34.04 17.14,34.04 | 17.14,34.04 16.76,33.66 16.76,32.51 17.02,32.26 20.83,32.26 21.59,33.02 21.59,33.4 22,33.81 24.64,33.81 25.04,33.4 25.04,31.22 26.9,29.36 26.9,25.5 25.65,24.26 v25.65,22.99
A0
  Top 0.152: X3.2 16.84,24.41 16.39,23.96 15.95,23.96 14.88,22.9 14.88,22.51 13.63,22.51 10.95,19.82 10.95,19.27 U1.A7
A0_5V  (via drill 0.25)
  Top 0.152: U1.B7 9.96,13.49 9.91,13.44 v9.91,11.94
  Bottom 0.152: U$1.A0 11.75,9.72 11,10.46 8.66,10.46 8.66,10.72 10.87,10.72 10.87,10.92 10.82,10.97 6.81,10.97 4.95,12.83 4.95,13.21 6.91,11.25 10.49,11.25 9.91,11.84 v9.91,11.94
A1
  Top 0.152: U1.A6 11.63,19.86 12.32,20.55 12.64,20.55 14.28,22.19 15.59,22.19 15.67,22.27 15.67,23.12 16.21,23.66 16.52,23.66 17.24,24.38 X3.3
A1_5V  (via drill 0.25)
  Top 0.152: U1.B6 10.98,14.39 10.46,14.91 v10.44,14.91
  Bottom 0.152: U$1.A1 14.29,9.34 13.04,10.58 11.56,10.58 11.56,11.04 arc45 11.55,11.06 11.18,11.42 arc-45 11.18,11.44 11.18,11.91 arc90 11.15,11.94 10.57,11.94 arc-90 10.54,11.96 10.54,12.17 arc-90 10.57,12.19 11.15,12.19 arc90 11.18,12.22 11.18,12.42 arc90 11.15,12.45 10.31,12.45 arc-90 10.29,12.47 10.29,12.68 arc-90 10.31,12.7 11.15,12.7 arc90 11.18,12.72 11.18,12.93 arc90 11.15,12.95 9.04,12.95 arc-90 9.02,12.98 9.02,13.18 arc-90 9.04,13.21 11.15,13.21 arc90 11.18,13.23 11.18,13.44 arc90 11.15,13.46 9.04,13.46 arc-90 9.02,13.49 9.02,13.72 11.18,13.72 11.18,13.97 9.91,13.97 9.91,14.91 v10.44,14.91
A2
  Top 0.152: X3.4 17.64,24.35 16.02,22.73 16.02,22.29 16.18,22.12 16.18,21.89 arc-90 16.15,21.87 15.54,21.87 14.4,21.87 12.77,20.24 12.66,20.24 12.28,19.86 U1.A5
A2_5V  (via drill 0.25)
  Top 0.152: v11.38,14.88 11.18,15.09 11.18,15.49 10.16,15.49 10.16,15.75 11.18,15.75 11.18,16 10.41,16 10.41,16.26 11.18,16.26 11.18,16.51 11.05,16.51 11.05,16.87 11.07,16.89 11.43,16.89 11.43,15.49 11.68,15.49 11.68,16.76 11.91,16.76 11.91,14.4 11.63,14.12 U1.B5
  Bottom 0.152: U$1.A2 16.83,10.03 16.41,10.45 13.8,10.45 13.23,11.02 12.19,11.02 11.56,11.66 11.56,14.88 v11.38,14.88
A3
  Top 0.152: X3.5 18.04,24.32 16.52,22.8 arc45 16.52,22.79 16.52,21.79 16.61,21.79 arc-90 16.64,21.77 16.64,21.55 arc-90 16.62,21.54 14.61,21.54 12.93,19.86 U1.A4
A3_5V  (via drill 0.25)
  Top 0.152: v12.24,11.89 12.24,11.38 12.32,11.3 13.34,11.3 13.34,11.05 12.19,11.05 12.19,10.79 13.34,10.79 13.34,10.54 11.3,10.54 10.92,10.92 10.92,12.27 11.18,12.27 11.18,11.05 11.43,10.79 11.81,10.79 11.81,11.05 11.56,11.05 11.43,11.18 11.43,12.27 11.76,12.27 12.28,12.79 U1.B4
  Bottom 0.152: U$1.A3 19.37,9.65 18.57,10.45 16.98,10.45 16.68,10.76 14.06,10.76 13.46,11.35 12.8,11.35 v12.24,11.89
A4
  Top 0.152: X3.7 18.84,24.35 18.87,24.32 18.87,23.21 16.9,21.24 arc-45 16.88,21.23 14.77,21.23 arc45 14.75,21.23 13.59,20.07 arc45 13.58,20.05 U1.A3
A4_5V  (via drill 0.25)
  Top 0.152: v12.65,17.8 12.7,17.75 12.7,16.76 12.34,16.76 12.34,16.51 12.7,16.51 12.7,16.26 12.32,16.26 12.32,16 12.68,16 arc-90 12.7,15.98 12.7,15.77 arc-90 12.68,15.75 12.32,15.75 12.32,15.49 12.57,15.49 12.57,14.83 12.93,14.47 U1.B3
  Route2 0.152: v13.34,11.94 12.39,12.88 12.39,16.87 12.52,16.99 12.52,17.68 v12.65,17.8
  Bottom 0.152: U$1.A4 21.91,9.59 21.04,10.45 19.12,10.45 18.82,10.76 17.23,10.76 16.93,11.06 14.31,11.06 13.59,11.79 13.57,11.81 13.46,11.81 v13.34,11.94
A5
  Top 0.152: U1.A2 14.23,19.95 15.21,20.92 arc-45 15.22,20.93 17.04,20.93 18.84,22.73 arc-45 18.86,22.73 19.03,22.73 arc45 19.07,22.75 19.31,22.99 19.31,23.19 19.25,23.19 19.25,23.42 19.3,23.42 19.3,23.67 19.25,23.67 19.25,25.04 X3.8
A5_5V  (via drill 0.25)
  Top 0.152: v13.21,14.99 13.21,17.83 13.71,17.83 13.71,13.62 U1.B2
  Bottom 0.152: U$1.A5 24.45,9.72 23.71,10.45 21.48,10.45 21.17,10.76 19.25,10.76 18.95,11.06 17.36,11.06 17.05,11.37 14.8,11.37 13.21,12.95 v13.21,14.99
A6
  Top 0.152: U1.A1 14.88,19.86 15.65,20.62 17.17,20.62 18.41,21.87 18.68,21.87 18.69,21.88 18.75,21.88 18.94,22.06 18.78,22.21 18.78,22.24 18.95,22.4 18.97,22.4 19.1,22.28 19.64,22.82 X3.9
A6_5V  (via drill 0.25)
  Top 0.152: v15.24,11.92 15.24,11.18 14.99,10.92 14.1,10.92 14.1,11.18 14.61,11.18 14.61,11.43 14.1,11.43 14.1,11.68 14.61,11.68 14.61,11.94 14.1,11.94 14.1,12.19 14.38,12.19 14.38,12.42 14.23,12.56 U1.B1
  Bottom 0.152: U$1.A6 29.53,9.51 27.86,11.18 23.88,11.18 23.46,10.76 21.6,10.76 21.3,11.06 19.38,11.06 19.07,11.37 17.49,11.37 17.18,11.67 15.49,11.67 v15.24,11.92
A7
  Top 0.152: X3.10 20.07,25.02 20.07,24.51 19.95,24.39 19.95,22.64 18.88,21.57 arc-45 18.86,21.57 18.62,21.57 18.62,21.31 18.75,21.31 18.75,21.09 arc-90 18.72,21.07 18.12,21.07 17.37,20.32 15.88,20.32 15.53,19.98 U1.A0
A7_5V  (via drill 0.25)
  Top 0.152: v14.48,14.99 14.61,15.11 14.86,15.11 14.88,15.09 U1.B0
  Bottom 0.152: U$1.A7 32.07,9.49 30.89,10.67 29.52,10.67 28.7,11.48 19.39,11.48 19.2,11.67 17.61,11.67 17.31,11.98 16.34,11.98 14.48,13.84 v14.48,14.99
A8
  Top 0.152: X3.12 20.84,24.46 22.11,23.19 22.11,22.27 21.84,22 20.8,22 20.8,21.72 21.39,21.72 21.39,21.46 20.6,21.46 20.6,21.21 arc90 20.62,21.18 20.99,21.18 arc-90 21.02,21.16 U2.A7
A8_5V  (via drill 0.25)
  Top 0.152: U$1.A8 29.78,5.52 29.78,11.87 v29.72,11.94 | v20.32,12.06 20.32,13.46 U2.B7
  Bottom 0.152: v20.32,12.06 20.46,11.93 21.7,11.93 22.4,12.62 23.47,12.62 24,12.09 28.98,12.09 28.98,14.48 29.21,14.48 29.21,12.65 29.46,12.65 29.46,14.48 29.72,14.48 v29.72,11.94
A9
  Top 0.152: X3.13 21.24,24.49 22.42,23.32 22.42,22.04 21.97,21.59 21.92,21.59 21.72,21.39 21.72,21.34 22.1,21.34 22.1,21.08 21.39,21.08 21.34,21.03 21.34,20.83 21.97,20.83 21.97,20.57 21.32,20.57 21.32,20.32 21.49,20.32 21.67,20.14 U2.A6
A9_5V
  Top 0.152: U$1.A9 25.21,5.27 25.21,10.54 21.31,10.54 21.31,10.77 25.2,10.77 25.2,11 21.31,11 21.31,11.23 24.23,11.23 24.23,11.48 21.02,11.48 U2.B6
A10
  Top 0.152: X3.14 21.64,24.52 21.91,24.26 22.84,24.26 22.84,23.9 22.53,23.9 22.53,23.64 22.54,23.62 22.84,23.62 22.84,22.02 22.45,21.64 22.45,21.57 22.81,21.57 22.81,21.31 22.4,21.31 22.4,21.01 22.81,21.01 22.81,20.7 22.33,20.7 22.32,20.69 U2.A5
A10_5V  (via drill 0.25)
  Top 0.152: v20.19,16 19.6,16 19.6,14.77 19.18,14.35 18.34,14.35 18.34,14.1 19.3,14.1 19.3,13.87 18.34,13.87 18.34,12.32 18.67,12.32 18.67,12.06 17.96,12.06 17.91,12.02 17.91,11.81 18.67,11.81 18.67,11.56 17.45,11.56 17.4,11.51 17.4,11.3 18.67,11.3 18.67,11.05 17.02,11.05 17.02,10.79 18.67,10.79 18.67,10.54 17.14,10.54 16.83,10.22 U$1.A10 | v21.59,14.81 21.67,14.73 U2.B5
  Bottom 0.152: v21.59,14.81 21.39,14.81 v20.19,16
A11
  Top 0.152: X3.15 22.17,25.07 22.93,25.07 23.42,24.59 23.42,23.16 23.16,23.16 23.16,22.91 23.42,22.91 23.42,22.66 23.16,22.66 23.16,22.4 23.44,22.4 23.44,22.15 23.16,22.15 23.16,21.89 23.44,21.89 23.44,21.64 23.19,21.64 arc90 23.16,21.61 23.16,21.41 arc90 23.19,21.39 23.39,21.39 arc-90 23.41,21.36 23.41,20.69 22.97,20.24 U2.A4
A11_5V
  Top 0.152: U$1.A11 21.91,9.46 19.68,11.68 19.68,14.35 20.7,15.37 20.83,15.37 20.83,16.64 21.08,16.64 21.08,15.49 21.34,15.49 21.34,16.64 21.59,16.64 21.59,15.52 arc90 21.61,15.49 21.82,15.49 arc90 21.84,15.52 21.84,16.61 arc-90 21.87,16.64 22.05,16.64 arc-90 22.07,16.61 22.07,15.52 arc90 22.1,15.49 22.33,15.49 arc90 22.35,15.52 22.35,16.61 arc-90 22.38,16.64 22.58,16.64 arc-90 22.61,16.61 22.61,15.9 arc90 22.63,15.88 22.84,15.88 arc90 22.86,15.9 22.86,16.61 arc-90 22.89,16.64 23.06,16.64 arc-90 23.09,16.61 23.09,15.65 22.77,15.32 arc45 22.76,15.31 22.76,14.9 arc-45 22.75,14.88 22.32,14.45 arc45 22.32,14.43 U2.B4
A12
  Top 0.152: X3.16 23.02,25.65 23.76,24.91 23.76,24.25 23.89,24.12 23.89,22.91 23.75,22.91 23.75,22.66 23.96,22.66 23.96,22.4 23.75,22.4 23.75,22.15 23.96,22.15 23.96,21.89 23.75,21.89 23.75,21.64 23.96,21.64 23.96,21.39 23.75,21.39 23.75,21.13 23.96,21.13 23.96,20.88 23.74,20.88 23.74,20.62 23.96,20.62 23.96,20.46 23.62,20.12 U2.A3
A12_5V  (via drill 0.25)
  Top 0.152: v22.99,12.06 22.99,13.47 U2.B3
  Bottom 0.152: v22.99,12.06 23.27,11.79 28.83,11.79 29.64,10.97 33.22,10.97 33.22,10.67 33.78,10.67 33.78,11.71 34.04,11.71 34.04,10.54 34.29,10.54 34.29,11.71 34.54,11.71 34.54,10.54 34.8,10.54 34.8,11.71 35.2,11.71 35.2,10.39 34.61,9.79 U$1.A12
A13
  Top 0.152: X3.17 23.16,26.05 24.56,24.65 24.56,22.15 24.36,22.15 24.36,21.89 24.56,21.89 24.56,21.64 24.36,21.64 24.36,21.39 24.54,21.39 24.54,21.13 24.36,21.13 24.36,20.88 24.54,20.88 24.54,20.62 24.38,20.62 arc90 24.36,20.6 24.36,19.32 U2.A2
A13_5V
  Top 0.152: U2.B2 23.62,14.33 23.19,14.76 23.19,15.32 23.44,15.57 28.12,15.57 31.37,12.32 31.37,12.19 30.48,12.19 30.48,11.94 31.75,11.94 31.75,11.68 30.68,11.68 30.68,11.43 32.26,11.43 32.26,11.18 31.04,11.18 31.04,10.92 32.61,10.92 arc-90 32.64,10.9 32.64,10.69 arc-90 32.61,10.67 32.13,10.67 32.07,10.6 U$1.A13
A14_5V
  Top 0.152: U$1.A14 14.29,9.59 15.52,10.82 16.28,10.82 18.03,12.57 18.03,15.11 17.27,15.88 14.22,15.88 14.22,17.02 14.48,17.02 14.48,16.28 14.73,16.28 14.73,17.02 14.99,17.02 14.99,16.31 arc90 15.01,16.28 15.21,16.28 arc90 15.24,16.31 15.24,17.02 15.49,17.02 15.49,16.33 17.02,16.33 17.02,18.75 U$2.6
A15_5V
  Top 0.152: U$1.A15 34.61,9.64 28.37,15.88 24.64,15.88 22.99,17.53 22.35,17.53 22.35,17.14 22.1,17.14 22.1,17.53 21.84,17.53 21.84,17.14 21.59,17.14 21.59,17.53 21.34,17.53 21.34,17.14 21.08,17.14 21.08,17.53 20.83,17.53 20.83,17.14 20.57,17.14 20.57,17.53 20.32,17.53 20.32,17.2 19.2,17.2 U$2.3
D0  (via drill 0.25)
  Top 0.152: v21.53,26.29 21.69,26.45 X3.18 | v2.11,16.99 2.11,17.58 2.75,18.22 U0.A7 2.75,20.03 1.96,20.83 R8.P$2
  Bottom 0.152: v2.11,16.99 3.76,15.34 8.07,15.34 8.53,15.8 12.77,15.8 20.55,23.57 22.28,23.57 22.28,23.86 arc90 22.26,23.88 20.57,23.88 20.57,24.21 22.28,24.21 22.28,25.54 v21.53,26.29
D0_5V  (via drill 0.25)
  Top 0.152: U0.B7 2.1,14.98 v2.23,15.11
  Bottom 0.152: U$1.D0 9.21,9.46 8.1,10.57 6.78,10.57 v2.23,15.11
D1  (via drill 0.25)
  Top 0.152: v21.53,27.3 21.98,26.85 X3.19 | U0.A6 3.4,17.88 3.05,17.53 v3.05,16.99 3.05,16.48 3,16.43 1.85,16.43 1.5,16.79 1.5,17.3 R7.P$2
  Bottom 0.152: v21.53,27.3 20.99,27.3 arc90 20.97,27.28 20.97,25.06 20.21,24.3 arc-45 20.17,24.28 19.39,24.28 arc45 19.35,24.27 18.82,23.74 18.82,23.72 19.36,23.72 arc-90 19.41,23.67 19.41,23.52 arc-90 19.36,23.47 18.55,23.47 18.43,23.34 18.43,23.22 19.38,23.22 19.38,22.96 18.43,22.96 arc90 18.41,22.95 18.41,22.71 19.23,22.71 18.97,22.45 18.43,22.45 arc90 18.41,22.44 18.41,21.87 12.65,16.1 8.4,16.1 7.95,15.65 4.39,15.65 v3.05,16.99
D1_5V  (via drill 0.25)
  Top 0.152: U0.B6 2.75,12.47 2.22,11.94 v2.16,11.94
  Bottom 0.152: U$1.D1 6.67,9.86 2.88,13.64 1.75,13.64 1.75,13.34 1.96,13.34 1.96,13.03 1.78,13.03 arc90 1.75,13.01 1.75,12.32 2.13,11.94 v2.16,11.94
D2  (via drill 0.25)
  Top 0.152: v21.53,29.46 22.11,30.05 X3.27 | R6.P$2 4.05,20.7 U0.A5 3.99,19.16 v3.99,16.99
  Bottom 0.152: v21.53,29.46 21.22,29.46 20.89,29.13 20.89,28.17 19.37,26.65 19.37,25.68 20.6,25.68 20.6,25.45 19.38,25.45 19.38,25.17 20.5,25.17 20.12,24.79 19.41,24.79 arc45 19.38,24.78 18.05,23.45 arc45 18.03,23.41 18.03,21.92 12.52,16.41 8.28,16.41 7.82,15.95 5.03,15.95 v3.99,16.99
D2_5V  (via drill 0.25)
  Top 0.152: v3.43,11.94 3.43,13.46 U0.B5
  Bottom 0.152: U$1.D2 4.13,9.69 4.78,10.34 4.78,10.57 3.28,10.57 3.28,10.82 4.78,10.82 4.78,11.07 3.28,11.07 3.28,11.3 4.45,11.3 4.45,11.56 3.43,11.56 v3.43,11.94
D3  (via drill 0.25)
  Top 0.152: v24.45,31.75 24.45,31.7 23.2,30.45 X3.28 | U0.A4 4.7,17.27 v4.95,17.02 4.95,16.66 4.32,16.03 1.62,16.03 R5.P$2
  Bottom 0.152: v24.45,31.75 24.45,30.37 arc-45 24.43,30.34 24.23,30.14 arc-45 24.2,30.12 21.32,30.12 arc45 21.28,30.11 20.53,29.36 20.53,28.24 19.06,26.77 19.06,24.89 17.73,23.56 17.73,22.05 12.39,16.71 8.15,16.71 7.7,16.26 5.71,16.26 v4.95,17.02
D3_5V
  Top 0.152: U0.B4 4.05,11.07 3.53,11.07 3.53,11.33 3.28,11.33 3.28,11.07 3,11.07 3,11.33 2.77,11.33 arc90 2.74,11.3 2.74,10.52 1.7,9.47 1.59,9.36 U$1.D3
D4  (via drill 0.25)
  Top 0.152: v24.19,32.89 24.07,32.89 23.69,32.51 23.69,31.37 23.16,30.85 X3.29 | U0.A3 5.35,17.66 v5.97,17.04 5.97,17.02 4.65,15.7 1.73,15.7 1.53,15.5 1.53,14.6 R4.P$2
  Bottom 0.152: v24.19,32.89 24.62,32.89 24.62,32.33 24.18,32.33 23.69,31.84 23.69,30.53 arc-90 23.64,30.48 21.2,30.48 20.51,29.79 20.5,29.79 20.23,29.52 20.23,28.88 17.75,26.39 arc45 17.74,26.38 17.74,24.12 arc-45 17.73,24.11 10.67,17.04 8.05,17.04 7.57,16.56 6.45,16.56 v5.97,17.04
D4_5V
  Top 0.152: U0.B3 4.83,13.36 4.83,12.43 4.83,12.42 4.42,12.42 4.39,12.39 4.39,12.14 4.95,12.14 4.95,11.86 4.45,11.86 4.42,11.84 4.42,11.58 4.95,11.58 4.95,11.3 4.42,11.3 4.42,11.02 4.95,11.02 4.95,10.74 arc-90 4.93,10.72 3.23,10.72 arc90 3.2,10.69 3.2,10.49 arc90 3.23,10.46 4.95,10.46 4.13,9.64 U$1.D4
D5  (via drill 0.25)
  Top 0.152: v22.16,33.02 22.29,32.89 22.29,32.58 22.04,32.33 X3.31 | R3.P$2 6,20.79 U0.A2 6,18.15 v6.99,17.17
  Bottom 0.152: v22.16,33.02 22.16,31.1 21.84,30.79 21.07,30.79 20.38,30.1 19.92,29.64 19.92,29.13 17.69,26.89 14.45,26.89 14.17,26.62 14.17,26.29 arc90 14.36,26.1 14.85,26.1 arc-90 15.11,25.83 15.11,25.71 arc-90 14.85,25.45 14.36,25.45 arc90 14.1,25.18 14.1,25.06 arc90 14.36,24.8 14.85,24.8 arc-90 15.11,24.53 15.11,24.41 arc-90 14.85,24.14 14.66,24.14 14.66,23.5 15.54,23.5 15.54,22.4 10.51,17.37 7.19,17.37 v6.99,17.17
D5_5V
  Top 0.152: U$1.D5 6.5,5.44 6.5,9.68 5.77,10.41 5.56,10.41 5.56,10.87 5.33,10.87 5.33,11.15 5.64,11.15 5.64,11.43 5.31,11.43 5.31,11.73 5.64,11.73 5.64,12.01 5.31,12.01 5.31,12.24 5.61,12.24 5.61,12.5 5.38,12.5 5.35,12.53 U0.B2
D6  (via drill 0.25)
  Top 0.152: v20.13,30.66 20.25,30.79 21.03,30.79 21.64,31.39 X3.32 | U0.A1 6.72,19.16 6.72,18.45 8.29,16.88 R2.P$2 9.14,17.96 v9.17,17.98
  Bottom 0.152: v20.13,30.66 19.62,30.15 19.62,29.26 17.64,27.27 13.94,27.27 13.77,27.1 13.77,26.72 arc-90 13.5,26.45 12.71,26.45 arc90 12.45,26.18 12.45,26.07 arc90 12.71,25.81 13.5,25.81 arc-90 13.77,25.54 13.77,25.43 arc-90 13.5,25.17 12.71,25.17 arc90 12.45,24.9 12.45,24.79 arc90 12.71,24.52 13.5,24.52 arc-90 13.77,24.26 13.77,23.5 arc-90 13.5,23.23 13.2,23.23 arc90 12.9,22.93 arc90 13.15,22.68 14.53,22.68 arc-90 14.8,22.42 14.8,22.4 10.38,17.98 v9.17,17.98
D6_5V
  Top 0.152: U$1.D6 8.43,6.04 8.43,10.29 8.23,10.49 7.82,10.49 7.82,10.95 6.07,10.95 6,11.01 U0.B1
D7  (via drill 0.25)
  Top 0.152: v18.99,30.73 18.99,30.86 19.34,31.22 21.04,31.22 21.24,31.43 X3.33 | R1.P$2 7.99,20.69 7.3,20 U0.A0 7.3,18.49 7.61,18.19 8.38,18.19 v9.17,18.97
  Bottom 0.152: v18.99,30.73 18.99,30.48 19.32,30.15 19.32,29.38 17.7,27.76 14.69,27.76 14.69,27.77 13.16,27.77 12,26.6 12,26.04 arc-90 11.73,25.77 10.61,25.77 arc90 10.34,25.5 10.34,25.4 arc90 10.61,25.13 11.73,25.13 arc-90 12,24.87 12,24.77 arc-90 11.73,24.5 10.61,24.5 arc90 10.34,24.23 10.34,24.13 arc90 10.61,23.86 11.73,23.86 arc-90 12,23.6 12,23.5 arc-90 11.73,23.23 10.61,23.23 arc90 10.34,22.96 10.34,22.86 arc90 10.61,22.59 11.73,22.59 arc-90 12,22.33 12,22.22 arc-90 11.73,21.96 11.34,21.96 arc90 11.31,21.93 11.31,20 10.29,18.97 v9.17,18.97
D7_5V
  Top 0.152: U0.B0 6.65,11.76 7.11,11.3 10.36,11.3 10.36,10.95 8.99,10.95 arc90 8.97,10.92 8.97,10.69 arc90 8.99,10.67 10.67,10.67 11.18,10.16 11.18,5.84 U$1.D7
GND  (via drill 0.25, 0.35)
  Top 0.152: X2.2 28.71,29.51 C14.P$2 v29.4,29.84 | C13.P$2 v26.48,24.26 | ACT_LED.C 6.46,31.67 v6.48,31.65 | R7.P$1 v0.89,19.81 v0.9,19.82 R8.P$1 | R5.P$1 v0.89,14.86 | R2.P$1 9.53,15.88 10.96,17.32 v11.91,17.32 | 20.37,20.37 20.32,20.42 | U2.DIR 26.29,19.3 v27.5,19.3 | U1.DIR 16.18,17.58 v16.13,17.53 | R4.P$1 0.89,11.99 v0.84,11.94 | R3.P$1 4.96,21.44 | 4.96,21.44 4.96,21.55 | 4.96,21.55 v5.18,21.77 | R6.P$1 2.93,21.04 3.44,21.55 4.96,21.55 | R1.P$1 6.99,20.87 6.43,21.44 4.96,21.44
  Top 0.203: v18.29,16.19 U$2.2 | X2.4 26.48,25.4 25.72,25.4 v25.59,25.53 | v15.48,35.05 C24.P$2 | X3.47 14.86,30.85 C6.P$2
  Top 0.254: U1./OE 15.53,12.66 15.88,12.32 16.76,12.32 C4.P$1
  Top 0.305: X3.P$1 19.11,28.57
  Top 0.406: C3.P$1 20,34.87 v19.85,35.03 | v14.34,35.05 C20.P$2 | v25.46,29.77 C1.P$2 | C19.P$2 13.21,24.19 v13.21,23.81 | C23.P$2 v13.2,35.05 | v18.86,35.05 C5.P$2 | C15.P$2 25.59,26.28 v25.59,25.53 | C27.P$2 17.1,22.5 v17.1,22.27 | U0.GND 1.52,19.81 v0.89,19.81 | C2.P$1 9.14,12.7 8.76,12.32 v8.76,11.94 | U1./OE 15.53,14.9 v15.62,14.99 | C17.P$2 v28.32,12.95 | U2./OE 25.57,14.77 v25.78,14.99 | U2.GND 20.37,20.37 | 20.32,20.42 v20.32,20.57 | v10.34,20.5 U1.GND | C16.P$2 20.64,22.44 v20.04,21.84
  Top 0.508: U3.4 9.51,26.29 9.38,26.16 v9.34,26.16 | C18.P$2 1.7,23.83 v1.04,23.81 | C22.P$2 v23.05,35.05 | C8.P$2 v28.64,19.3 30.16,19.3 3V3_REG2.1 | C21.P$2 v12.13,28.32 | v33.97,20.95 C11.P$2 C25.P$2 v35.12,20.95 | 19.11,28.57 v17.16,28.57 | X3.P$1 20.38,27.3 v20.38,26.29 | C26.P$2 v27.5,19.3 | C6.P$2 C28.P$2 13.65,31.74 v13.69,31.77
  Bottom 0.152: USER_BUTTON.1 1.33,26.68 v1.32,26.67
  Bottom 0.508: v2.1,10.79 1.59,10.29 U$1.GND 1.59,10.22 1.02,10.79 v0.83,10.79
  pour Route2: -1.27,38.23 40.01,38.23 40.01,-1.27 -1.27,-1.27
N$6
  Top 0.152: R20.P$1 8.67,33.16 ACT_LED.A
N$9
  Top 0.152: D3.C 28.05,20.51 28.05,18.12 27.86,17.92 25.26,17.92 24.92,18.26 U2.A1
N$10
  Top 0.152: X3.22 23.46,28.05 23.69,27.81 R23.P$2
N$11
  Top 0.178: L1.P$2 13.07,30.48 15.35,30.48 15.37,30.45
  Top 0.203: X3.48 15.37,30.45
N$12
  Top 0.203: C23.P$1 13.32,33.16 | X3.46 15.14,31.85
  Top 0.254: 13.32,33.16 14.63,31.85 15.14,31.85
  Top 0.406: R9.P$1 C23.P$1
N$13
  Top 0.203: X3.44 16.84,32.94 R25.P$1 C24.P$1
QSPI_SCLK
  Top 0.152: X3.56 14.28,27.25 13.97,26.93 2.83,26.93 arc45 2.76,26.91 2.43,26.57 arc45 2.4,26.5 2.4,25.9 arc45 2.43,25.83 2.6,25.65 3.87,25.65 4,25.53 4,25.02 U3.6
QSPI_SD0
  Top 0.152: X3.57 14.47,26.85 14.19,26.57 12.59,26.57 11.56,25.54 8.92,25.54 arc-45 8.74,25.61 8.6,25.75 arc-45 8.57,25.82 8.57,26.25 arc45 8.54,26.32 8.45,26.42 8.32,26.42 8.22,26.32 arc45 8.19,26.25 8.19,25.91 8.06,25.78 7.94,25.78 7.81,25.91 7.81,26.29 7.68,26.42 7.56,26.42 7.43,26.29 7.43,25.91 7.3,25.78 7.18,25.78 7.05,25.91 7.05,26.29 6.92,26.42 6.79,26.42 6.67,26.29 6.67,25.91 6.54,25.78 6.41,25.78 6.29,25.91 6.29,26.29 6.16,26.42 6.03,26.42 5.91,26.29 5.91,25.91 5.78,25.78 5.65,25.78 5.52,25.91 5.52,26.29 5.37,26.44 5.3,26.44 5.14,26.29 5.14,25.91 5.02,25.78 4.89,25.78 4.38,26.29 U3.5
QSPI_SD1
  Top 0.152: U3.2 5.88,23.75 arc45 5.7,23.68 5.52,23.5 5.52,23.35 arc45 5.6,23.17 5.77,23 11.46,23 arc45 11.64,23.07 11.99,23.42 arc45 12.06,23.6 12.06,24.15 arc-45 12.14,24.33 12.37,24.56 arc45 12.45,24.74 12.45,25.27 12.95,25.78 14.61,25.78 14.87,26.05 X3.59
QSPI_SD2
  Top 0.152: U3.3 8.7,25.02 8.32,25.4 5.55,25.4 5.37,25.22 arc45 5.3,25.04 5.3,24.64 5.55,24.38 11.58,24.38 arc45 11.76,24.46 12.05,24.75 arc45 12.13,24.93 12.13,25.36 arc-45 12.2,25.54 12.78,26.12 arc-45 12.96,26.19 14.34,26.19 arc45 14.52,26.27 14.63,26.37 arc-45 14.81,26.45 X3.58
QSPI_SD3
  Top 0.152: U3.7 2.98,23.75 2.24,24.49 arc-45 2.1,24.84 2.1,26.76 arc-45 2.12,26.83 2.41,27.11 arc-45 2.77,27.26 13.74,27.26 14.12,27.65 X3.55
QSPI_SS
  Top 0.152: X3.60 15.17,25.65 14.89,25.37 13.68,25.37 13.68,25.38 12.98,25.38 12.83,25.22 12.83,24.62 arc-45 12.75,24.44 12.46,24.14 arc45 12.38,23.96 12.38,22.01 arc-45 12.35,21.94 12.29,21.87 arc-45 12.21,21.84 6.42,21.84 arc-45 6.24,21.92 arc-45 6.18,22.05 6.18,22.41 arc-45 6.24,22.53 arc-45 6.42,22.61 10.78,22.61 U3.1
ROMRQ  (via drill 0.25)
  Top 0.152: U$2.4 18.94,19.04 20.07,17.91 23.62,17.91 v24.77,16.76 | v24.77,14.99 24.92,14.83 U2.B0
  Bottom 0.152: v24.77,16.76 v24.77,14.99
ROMRQ_3V3  (via drill 0.25)
  Top 0.152: v21.3,34.04 20.73,34.04 20.37,33.67 18.53,33.67 18.33,33.47 18.33,32.82 18.44,32.71 X3.40 | v25.53,20.7 25.57,20.66 U2.A0 | U0./OE 7.3,14.69 v7.24,14.76
  Bottom 0.152: v21.3,34.04 21.79,34.04 21.87,34.11 24.77,34.11 25.35,33.53 25.35,31.34 27.2,29.49 27.2,22.5 25.53,20.83 v25.53,20.7 25.53,19.05 23.37,16.89 14.3,16.89 12.9,15.49 8.66,15.49 8.2,15.04 7.52,15.04 v7.24,14.76
RUN
  Top 0.152: X3.26 23.11,29.65 24.64,31.18 25.28,31.18 25.54,31.43 R24.P$1
SWCLK
  Top 0.152: X3.24 23.32,28.85 24.96,30.48 29.91,30.48 JP2.3
SWD
  Top 0.152: X3.25 23.21,29.25 24.75,30.79 31.23,30.79 JP2.2
USER_BUT  (via drill 0.25)
  Top 0.152: X3.42 17.64,30.82 v17.63,30.81
  Bottom 0.152: v17.63,30.81 9.6,30.81 7.03,28.23 USER_BUTTON.3
USER_LED  (via drill 0.25)
  Top 0.152: X3.34 20.84,32.33 21.02,32.51 21.34,32.51 21.53,32.7 21.53,33.4 22.04,33.91 22.04,34.92 v21.91,35.05 | v9.84,35.05 R20.P$2
  Bottom 0.152: v21.91,35.05 21.78,35.18 20.82,35.18 20.05,34.42 18.35,34.42 18.02,34.75 17.46,34.75 17.13,34.42 10.35,34.42 9.84,34.92 v9.84,35.05
VCC  (via drill 0.25)
  Top 0.406: v7.62,11.94 7.62,12.06 7.95,12.4 U0.VCC 8.44,13.97 C2.P$2 9.12,13.99 v9.12,14.78
  Top 0.508: C11.P$1 C25.P$1 v35.12,18.16 | C11.P$1 34.04,18.99 v34.04,18.16 | 3V3_REG2.3 33.1,19.05 C11.P$1
  Top 0.762: U$1.5V 37.15,10.54 | 37.15,10.54 v37.78,11.18 | 37.15,10.54 36.51,11.18 v36.01,11.18
  pour Route15: -2.54,12.7 -2.54,-2.54 41.27,-2.54 41.27,39.37 33.66,39.37 33.66,27.3 30.48,24.13 30.48,13.34 30.48,12.7
XIN
  Top 0.152: X3.21 23.29,27.65 23.76,27.18 27.88,27.18 28.71,26.34 X2.1 28.71,24.59 C13.P$1
XOUT
  Top 0.152: R23.P$1 26.69,27.81 X2.3 27.11,29.58 C14.P$1

### Text on the board
tPlace: ACT | JLCJLCJLCJLC | ZXelerator V1.2 / 2025 Smashcat
bPlace: 3V3 | SWD | CLK | ZXR | GND